# Altium schematic sheet Display.SchDoc
size A; SheetNumber: 3; SheetTotal: 5
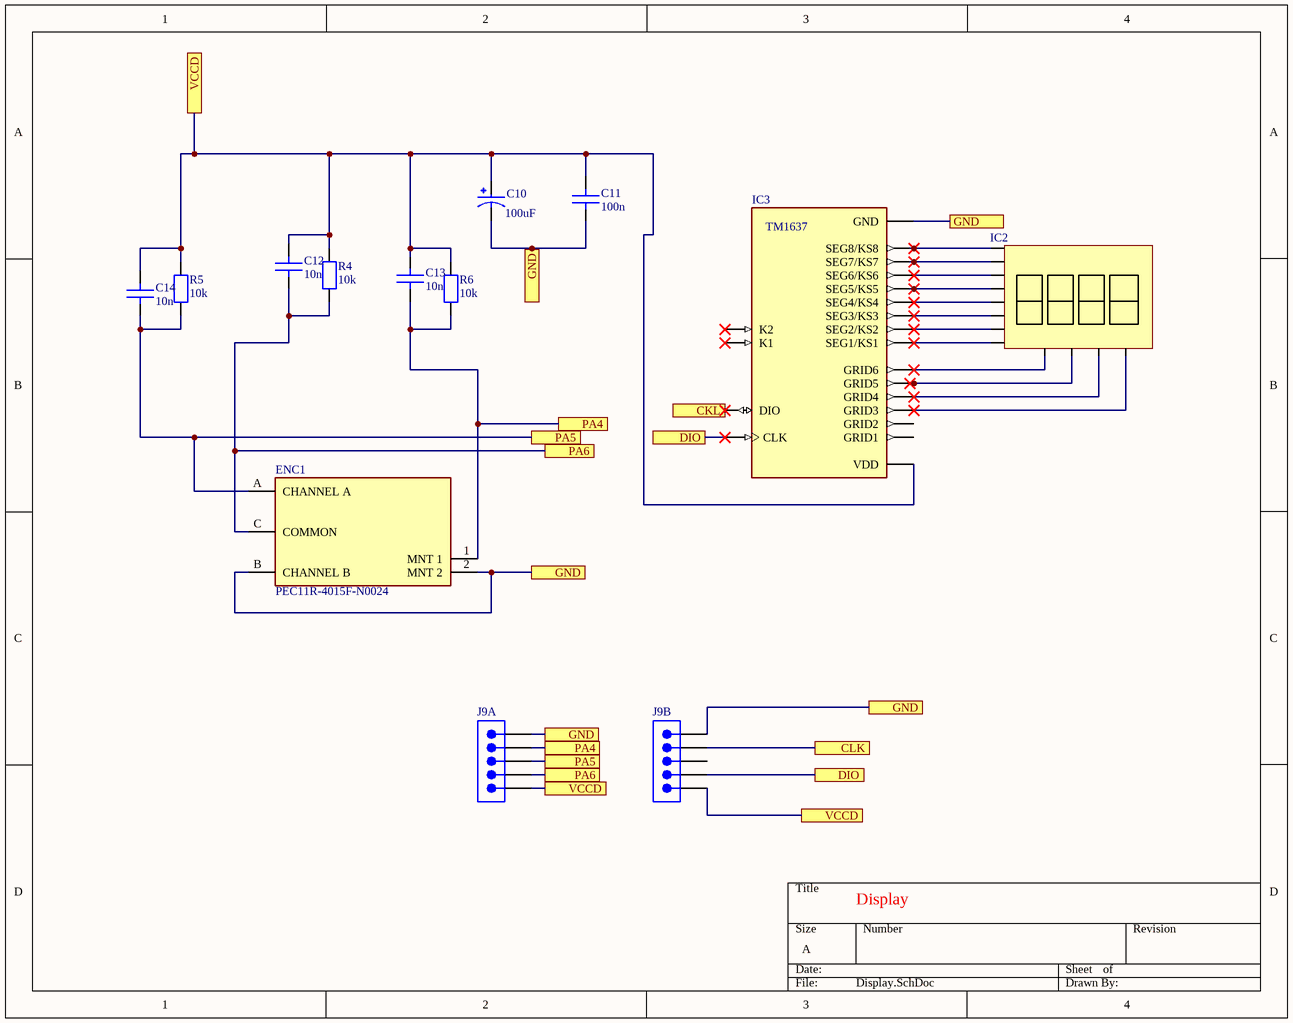
[diagram p0: Display.SchDoc]

## Parts
C10  100uF  [CAPPRD350W60D800H1150]
C11  100n  [CAP_0805]
C12  10n  [CAP_0805]
C13  10n  [CAP_0805]
C14  10n  [CAP_0805]
ENC1  PEC11R-4015F-N0024  [FP-PEC11R-4015F-N0024-MFG]
IC2  KW4-801AVB  [LTC46454G]  (value not drawn)
IC3  TM1637  [DIP778W43P254L2612H431Q20N]
J9A  61300511121  [61300511121]  (value not drawn)
J9B  61300511121  [61300511121]  (value not drawn)
R4  10k  [RES_0805]
R5  10k  [RES_0805]
R6  10k  [RES_0805]

## Ports
CKL, CLK, DIO, DIO (see Display[3B]), GND, PA4, PA5, PA6, VCCD, VCCD (see Display[1A], Display[2D]), VCCD (see Display[2D], Display[3D])

## Nets
CKL: IC3.17(DIO) ; port CKL
CLK: J9B.4 ; port CLK
DIO: IC3.18(CLK) J9B.2 ; port DIO
GND: C10.N C11.1 ENC1.2(MNT_2) ENC1.B(CHANNEL_B) IC3.1(GND) J9A.5 J9B.5 ; port GND
PA4: C13.2 ENC1.1(MNT_1) J9A.4 R6.1 ; port PA4
PA5: C14.1 ENC1.A(CHANNEL_A) J9A.3 R5.1 ; port PA5
PA6: C12.1 ENC1.C(COMMON) J9A.2 R4.2 ; port PA6
VCCD: C10.P C11.2 C12.2 C13.1 C14.2 IC3.16(VDD) J9A.1 J9B.1 R4.1 R5.2 R6.2 ; port VCCD

Not connected (* = marked no-connect by the designer): IC3 2(SEG1/KS1)* 3(SEG2/KS2)* 4(SEG3/KS3)* 5(SEG4/KS4)* 6(SEG5/KS5)* 7(SEG6/KS6)* 8(SEG7/KS7)* 9(SEG8/KS8)* 10(GRID6)* 11(GRID5)* 12(GRID4)* 13(GRID3)* 14(GRID2) 15(GRID1) 19(K1)* 20(K2)*; J9B 3

## Notes on the sheet
- Display

## Library data of the parts
C10 = Capacitor: Capacitor 100 μF, 50 V, steek 3,5 mm, 8x11 mm, generic.
C11-C14 = CAP_0805: Capacitor SMD 0805 generic.; Manufacturer: *; Manufacture Part N: *; Tolerence: *; Voltage Rating: *; Dielectric: *
ENC1 = CMP-07421-000003-1: ROTARY ENCODER MECHANICAL 24PPR; Manufacturer: Bourns; Current Rating: 10mA; Number Of Circuits: 1; Conn Orientation: Vertical; Encoder Type: Incremental; Detent: No; Pulses Per Rev: 24; Voltage Rating Dc: 5V; Manufacturer Part Number: PEC11R-4015F-N0024; Height: 22.3mm; ComponentLink2URL: https://www.bourns.com/docs/product-datasheets/pec11r.pdf?sfvrsn=bb617cbf_7; Mouser Description: Encoders 15mm SHAFT NO SWITCH; Package: 0; RoHS: TRUE; Temperature Range High: +70°C; Device Class L1: Electromechanical; Device Class L3: Encoders; Temperature Range Low: -30°C; Device Class L2: Switches; Temperature: -30°C to +70°C; Category: Enc; ComponentLink2Description: Datasheet; Lead Free: Yes; Automotive: No; Octopart: https://octopart.com/pec11r-4015f-n0024-bourns-26648251; Digikey Description: ROTARY ENCODER MECHANICAL 24PPR
IC2 = KW4-801AVB: SEVEN_SEG Diplay 4digits
J9A J9B = 61300511121: Board Connector, 5 Contact(s), 1 Row(s), Male, Straight, 0.1 inch Pitch, Solder Terminal, Locking, Black Insulator, Plug; Manufacturer: Wurth Electronics; Contact Pattern: RECTANGULAR; Contact Resistance: 20mR; Contact Style: SQ PIN-SKT; Dielectric Withstanding Voltage (AC): 500V; Insulation Resistance: 1GR; Number Of Connectors: 1; Rated Current (Signal): 3A; Number of Contacts: 5; Body Length: 0.5inch; Reference Standard: UL; Reliability: COMMERCIAL; Supplier: Rs; Supplier Part Number: 8281597P; Manufacturer Part Number: 61300511121; RoHS: Yes; Category: Headers and Wire Housings; Stock: 1085; Pricing: 125=0.136, 500=0.116, 2500=0.11, 5000=0.102 (EUR); Mounting Technology: Board; Contact Material: Copper Alloy; Contact Finish - Mating: GOLD; Contact Finish - Termination: Gold (Au) - with Nickel (Ni) barrier; Insulation Color: Black; Insulation Material: Polybutylene; Min Operating Temperature: -40°C; Max Operating Temperature: 125°C; Connector Type: BOARD CONNECTOR; JESD-609 Code: e4; Body/Shell Style: PLUG; Contact Gender: Male; Mounting Style: STRAIGHT; Number of Rows Loaded: 1; PCB Contact Pattern: RECTANGULAR; Termination: Solder; Body Breadth: 0.1inch; Body Depth: 0.1inch; Mating Contact Pitch: 0.1inch; Mounting Option 1: LOCKING; Terminal Length: 0.118inch; Terminal Pitch: 2.54mm; Reach SVHC Compliant: Yes; RoHS Compliant: Yes; ComponentLink1URL: https://datasheet.ciiva.com:443/pdfs/VipMasterIC/IC/MIDC/MIDCS07676/MIDCS07676-1.pdf?src-supplier=IHS+Markit; ComponentLink1Description: https://datasheet.ciiva.com:443/pdfs/VipMasterIC/IC/MIDC/MIDCS07676/MIDCS07676-1.pdf?src-supplier=IHS+Markit; ComponentLink2URL: http://www.farnell.com/cad/1737268.pdf?src-supplier=Element14; ComponentLink2Description: http://www.farnell.com/cad/1737268.pdf?src-supplier=Element14; ComponentLink3URL: https://datasheet.octopart.com/61300511121-W%C3%BCrth-Elektronik-datasheet-21154836.pdf?src-supplier=Element14; ComponentLink3Description: https://datasheet.octopart.com/61300511121-W%C3%BCrth-Elektronik-datasheet-21154836.pdf?src-supplier=Element14; ComponentLink4URL: https://katalog.we-online.de/em/datasheet/6130xx11121.pdf?src-supplier=Digikey; ComponentLink4Description: https://katalog.we-online.de/em/datasheet/6130xx11121.pdf?src-supplier=Digikey
R4-R6 = RES_0805: SMD size 0805 Generic.; Manufacturer: *; Manufacture Part N: *; Tolerence: *; Package Size: *; Voltage Rating: *